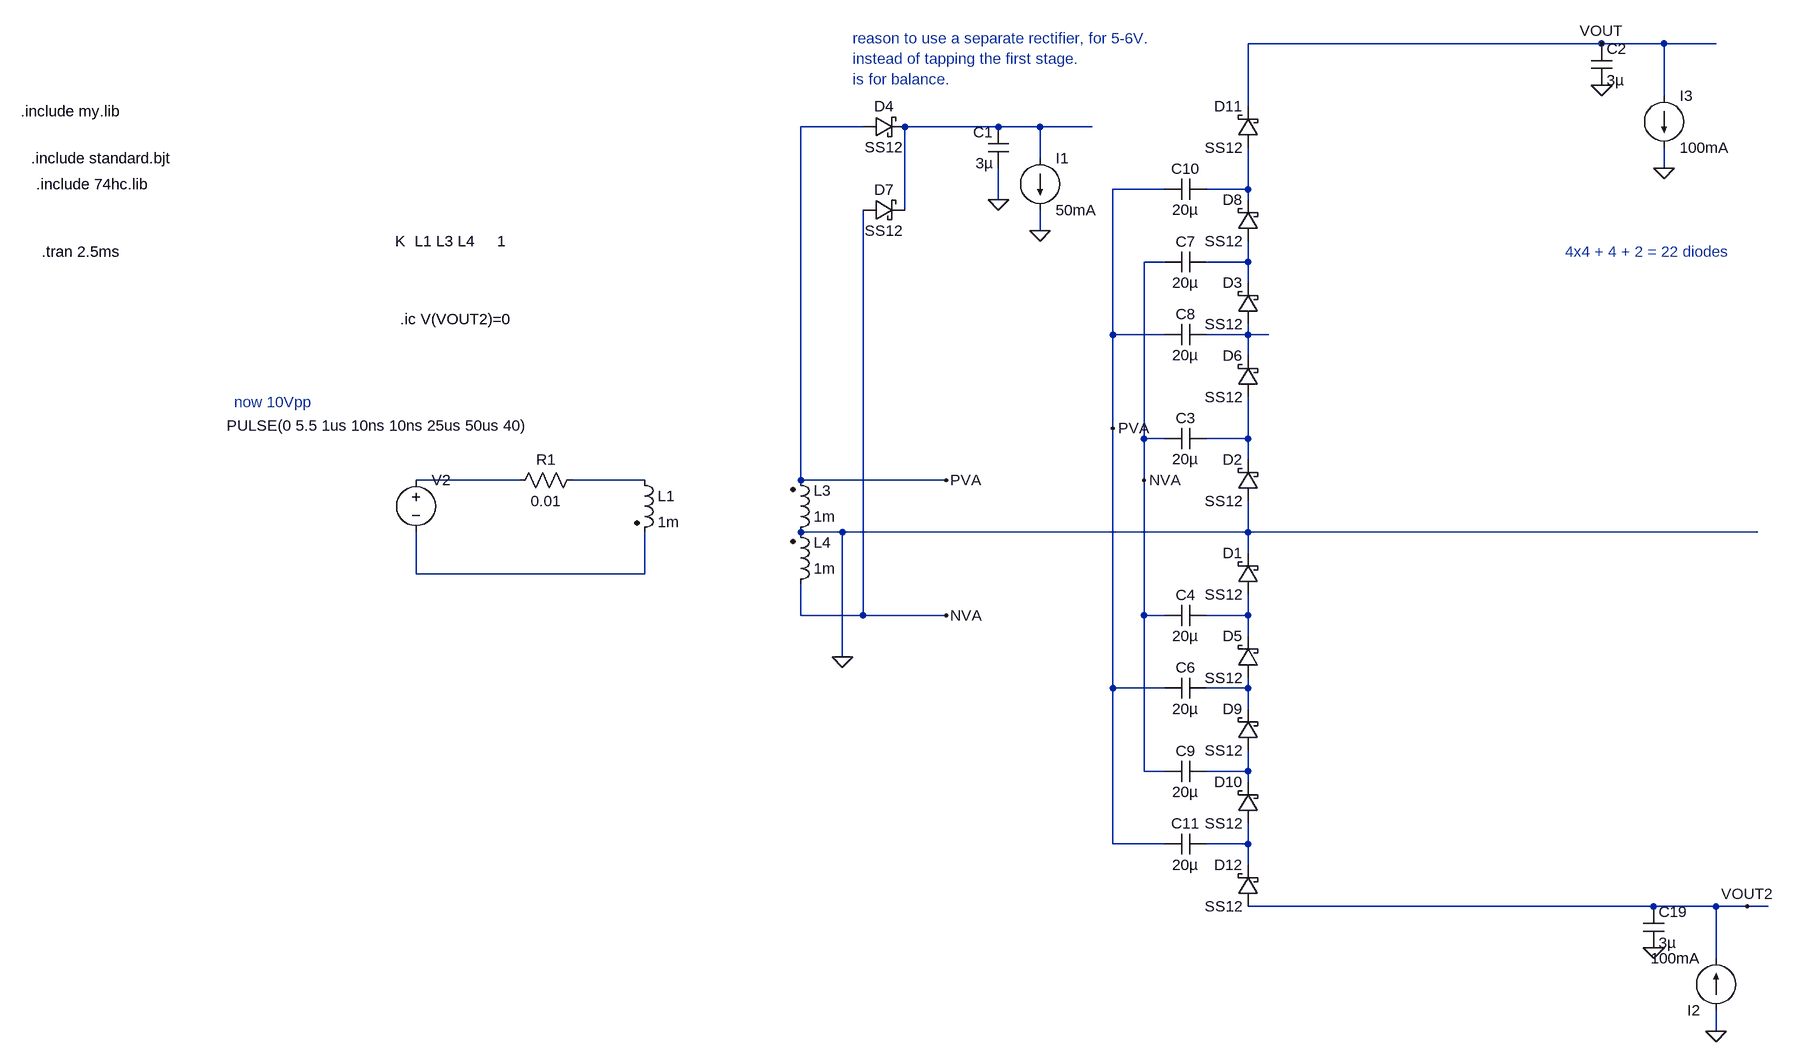
[diagram p0: schematic Draft104.asc]
Draft104.asc, the LTspice schematic file:
Version 4
SHEET 1 5720 1740
WIRE 2976 -800 2432 -800
WIRE 3072 -800 2976 -800
WIRE 3152 -800 3072 -800
WIRE 3072 -720 3072 -800
WIRE 2432 -704 2432 -800
WIRE 1840 -672 1744 -672
WIRE 2048 -672 1904 -672
WIRE 2112 -672 2048 -672
WIRE 2192 -672 2112 -672
WIRE 2112 -624 2112 -672
WIRE 3072 -608 3072 -640
WIRE 2304 -576 2224 -576
WIRE 2432 -576 2432 -640
WIRE 2432 -576 2368 -576
WIRE 2048 -560 2048 -608
WIRE 2432 -560 2432 -576
WIRE 1904 -544 1904 -672
WIRE 2112 -512 2112 -544
WIRE 2304 -464 2272 -464
WIRE 2432 -464 2432 -496
WIRE 2432 -464 2368 -464
WIRE 2432 -432 2432 -464
WIRE 2224 -352 2224 -576
WIRE 2304 -352 2224 -352
WIRE 2432 -352 2432 -368
WIRE 2432 -352 2368 -352
WIRE 2464 -352 2432 -352
WIRE 2432 -320 2432 -352
WIRE 2224 -208 2224 -352
WIRE 2272 -192 2272 -464
WIRE 2304 -192 2272 -192
WIRE 2432 -192 2432 -256
WIRE 2432 -192 2368 -192
WIRE 2432 -160 2432 -192
WIRE 1312 -128 1152 -128
WIRE 1504 -128 1392 -128
WIRE 1744 -128 1744 -672
WIRE 1968 -128 1744 -128
WIRE 2272 -128 2272 -192
WIRE 1808 -48 1744 -48
WIRE 2432 -48 2432 -96
WIRE 2432 -48 1808 -48
WIRE 3216 -48 2432 -48
WIRE 2432 -16 2432 -48
WIRE 1152 16 1152 -48
WIRE 1504 16 1504 -48
WIRE 1504 16 1152 16
WIRE 1744 80 1744 32
WIRE 1840 80 1840 -544
WIRE 1840 80 1744 80
WIRE 1968 80 1840 80
WIRE 2272 80 2272 -128
WIRE 2304 80 2272 80
WIRE 2432 80 2432 48
WIRE 2432 80 2368 80
WIRE 2432 112 2432 80
WIRE 1808 144 1808 -48
WIRE 2224 192 2224 -208
WIRE 2304 192 2224 192
WIRE 2432 192 2432 176
WIRE 2432 192 2368 192
WIRE 2432 224 2432 192
WIRE 2272 320 2272 80
WIRE 2304 320 2272 320
WIRE 2432 320 2432 288
WIRE 2432 320 2368 320
WIRE 2432 336 2432 320
WIRE 2224 432 2224 192
WIRE 2304 432 2224 432
WIRE 2432 432 2432 400
WIRE 2432 432 2368 432
WIRE 2432 464 2432 432
WIRE 3056 528 2432 528
WIRE 3152 528 3056 528
WIRE 3200 528 3152 528
WIRE 3232 528 3200 528
WIRE 3152 608 3152 528
WIRE 3152 720 3152 688
FLAG 1808 144 0
FLAG 2976 -800 VOUT
FLAG 3072 -608 0
FLAG 2048 -560 0
FLAG 2112 -512 0
FLAG 2976 -736 0
FLAG 1968 -128 PVA
FLAG 2224 -208 PVA
FLAG 1968 80 NVA
FLAG 2272 -128 NVA
FLAG 3152 720 0
FLAG 3056 592 0
FLAG 3200 528 VOUT2
SYMBOL ind2 1728 -32 M180
WINDOW 0 36 80 Left 2
WINDOW 3 36 40 Left 2
SYMATTR InstName L3
SYMATTR Value 1m
SYMATTR Type ind
SYMBOL ind2 1728 48 M180
WINDOW 0 36 80 Left 2
WINDOW 3 36 40 Left 2
SYMATTR InstName L4
SYMATTR Value 1m
SYMATTR Type ind
SYMBOL ind2 1488 -144 R0
SYMATTR InstName L1
SYMATTR Value 1m
SYMATTR Type ind
SYMBOL voltage 1152 -144 R0
WINDOW 123 0 0 Left 0
WINDOW 39 0 0 Left 0
WINDOW 3 -291 -68 Left 2
SYMATTR Value PULSE(0 5.5 1us 10ns 10ns 25us 50us 40)
SYMATTR InstName V2
SYMBOL cap 2368 -208 R90
WINDOW 0 0 32 VBottom 2
WINDOW 3 32 32 VTop 2
SYMATTR InstName C3
SYMATTR Value 20µ
SYMBOL cap 2368 64 R90
WINDOW 0 0 32 VBottom 2
WINDOW 3 32 32 VTop 2
SYMATTR InstName C4
SYMATTR Value 20µ
SYMBOL current 3072 -720 R0
WINDOW 123 0 0 Left 0
WINDOW 39 0 0 Left 0
SYMATTR InstName I3
SYMATTR Value 100mA
SYMBOL schottky 2448 -96 R180
WINDOW 0 24 64 Left 2
WINDOW 3 24 0 Left 2
SYMATTR InstName D2
SYMATTR Value SS12
SYMATTR Description Diode
SYMATTR Type diode
SYMBOL schottky 2448 176 R180
WINDOW 0 24 64 Left 2
WINDOW 3 24 0 Left 2
SYMATTR InstName D5
SYMATTR Value SS12
SYMATTR Description Diode
SYMATTR Type diode
SYMBOL schottky 2448 48 R180
WINDOW 0 24 64 Left 2
WINDOW 3 24 0 Left 2
SYMATTR InstName D1
SYMATTR Value SS12
SYMATTR Description Diode
SYMATTR Type diode
SYMBOL schottky 2448 -256 R180
WINDOW 0 24 64 Left 2
WINDOW 3 24 0 Left 2
SYMATTR InstName D6
SYMATTR Value SS12
SYMATTR Description Diode
SYMATTR Type diode
SYMBOL schottky 2448 -368 R180
WINDOW 0 24 64 Left 2
WINDOW 3 24 0 Left 2
SYMATTR InstName D3
SYMATTR Value SS12
SYMATTR Description Diode
SYMATTR Type diode
SYMBOL cap 2368 -368 R90
WINDOW 0 0 32 VBottom 2
WINDOW 3 32 32 VTop 2
SYMATTR InstName C8
SYMATTR Value 20µ
SYMBOL schottky 2448 288 R180
WINDOW 0 24 64 Left 2
WINDOW 3 24 0 Left 2
SYMATTR InstName D9
SYMATTR Value SS12
SYMATTR Description Diode
SYMATTR Type diode
SYMBOL res 1408 -144 R90
WINDOW 0 0 56 VBottom 2
WINDOW 3 32 56 VTop 2
SYMATTR InstName R1
SYMATTR Value 0.01
SYMBOL schottky 1840 -656 R270
WINDOW 0 32 32 VTop 2
WINDOW 3 0 32 VBottom 2
SYMATTR InstName D4
SYMATTR Value SS12
SYMATTR Description Diode
SYMATTR Type diode
SYMBOL schottky 1840 -528 R270
WINDOW 0 32 32 VTop 2
WINDOW 3 0 32 VBottom 2
SYMATTR InstName D7
SYMATTR Value SS12
SYMATTR Description Diode
SYMATTR Type diode
SYMBOL cap 2064 -608 R180
WINDOW 0 24 56 Left 2
WINDOW 3 24 8 Left 2
SYMATTR InstName C1
SYMATTR Value 3µ
SYMBOL current 2112 -624 R0
WINDOW 123 0 0 Left 0
WINDOW 39 0 0 Left 0
SYMATTR InstName I1
SYMATTR Value 50mA
SYMBOL cap 2368 176 R90
WINDOW 0 0 32 VBottom 2
WINDOW 3 32 32 VTop 2
SYMATTR InstName C6
SYMATTR Value 20µ
SYMBOL schottky 2448 -496 R180
WINDOW 0 24 64 Left 2
WINDOW 3 24 0 Left 2
SYMATTR InstName D8
SYMATTR Value SS12
SYMATTR Description Diode
SYMATTR Type diode
SYMBOL cap 2368 -480 R90
WINDOW 0 0 32 VBottom 2
WINDOW 3 32 32 VTop 2
SYMATTR InstName C7
SYMATTR Value 20µ
SYMBOL cap 2368 304 R90
WINDOW 0 0 32 VBottom 2
WINDOW 3 32 32 VTop 2
SYMATTR InstName C9
SYMATTR Value 20µ
SYMBOL schottky 2448 400 R180
WINDOW 0 24 64 Left 2
WINDOW 3 24 0 Left 2
SYMATTR InstName D10
SYMATTR Value SS12
SYMATTR Description Diode
SYMATTR Type diode
SYMBOL cap 2368 -592 R90
WINDOW 0 0 32 VBottom 2
WINDOW 3 32 32 VTop 2
SYMATTR InstName C10
SYMATTR Value 20µ
SYMBOL cap 2368 416 R90
WINDOW 0 0 32 VBottom 2
WINDOW 3 32 32 VTop 2
SYMATTR InstName C11
SYMATTR Value 20µ
SYMBOL schottky 2448 -640 R180
WINDOW 0 24 64 Left 2
WINDOW 3 24 0 Left 2
SYMATTR InstName D11
SYMATTR Value SS12
SYMATTR Description Diode
SYMATTR Type diode
SYMBOL schottky 2448 528 R180
WINDOW 0 24 64 Left 2
WINDOW 3 24 0 Left 2
SYMATTR InstName D12
SYMATTR Value SS12
SYMATTR Description Diode
SYMATTR Type diode
SYMBOL cap 2960 -800 R0
SYMATTR InstName C2
SYMATTR Value 3µ
SYMBOL current 3152 688 R180
WINDOW 123 0 0 Left 0
WINDOW 39 0 0 Left 0
SYMATTR InstName I2
SYMATTR Value 100mA
SYMBOL cap 3040 528 R0
SYMATTR InstName C19
SYMATTR Value 3µ
TEXT 576 -480 Left 2 !.tran 2.5ms
TEXT 1120 -496 Left 2 !K  L1 L3 L4     1
TEXT 560 -624 Left 2 !.include standard.bjt
TEXT 544 -696 Left 2 !.include my.lib
TEXT 568 -584 Left 2 !.include 74hc.lib
TEXT 872 -248 Left 2 ;now 10Vpp
TEXT 1824 -808 Left 2 ;reason to use a separate rectifier, for 5-6V.\ninstead of tapping the first stage.\nis for balance.
TEXT 1128 -376 Left 2 !.ic V(VOUT2)=0
TEXT 2920 -480 Left 2 ;4x4 + 4 + 2 = 22 diodes

The netlist it stands for:
* Draft104.asc
L3 0 PVA 1m
L4 NVA 0 1m
L1 N007 N008 1m
V2 N006 N008 PULSE(0 5.5 1us 10ns 10ns 25us 50us 40)
C3 N005 NVA 20µ
C4 N009 NVA 20µ
I3 VOUT 0 100mA
D2 0 N005 SS12
D5 N010 N009 SS12
D1 N009 0 SS12
D6 N005 N004 SS12
D3 N004 N003 SS12
C8 N004 PVA 20µ
D9 N011 N010 SS12
R1 N007 N006 0.01
D4 PVA N001 SS12
D7 NVA N001 SS12
C1 0 N001 3µ
I1 N001 0 50mA
C6 N010 PVA 20µ
D8 N003 N002 SS12
C7 N003 NVA 20µ
C9 N011 NVA 20µ
D10 N012 N011 SS12
C10 N002 PVA 20µ
C11 N012 PVA 20µ
D11 N002 VOUT SS12
D12 VOUT2 N012 SS12
C2 VOUT 0 3µ
I2 0 VOUT2 100mA
C19 VOUT2 0 3µ
.model D D
.lib standard.dio
.tran 2.5ms
K  L1 L3 L4     1
.include standard.bjt
.include my.lib
.include 74hc.lib
* now 10Vpp
* reason to use a separate rectifier, for 5-6V.
* instead of tapping the first stage.
* is for balance.
.ic V(VOUT2)=0
* 4x4 + 4 + 2 = 22 diodes
.backanno
.end